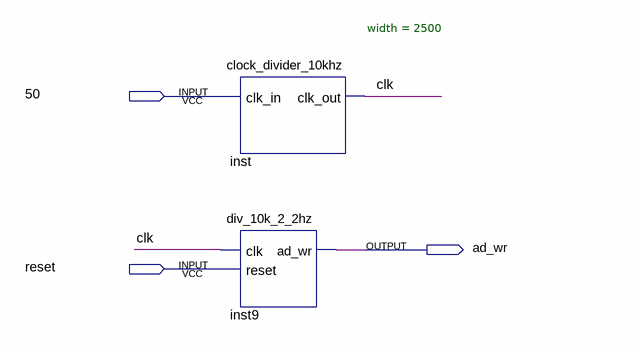
[diagram p0: schematic sheet]
// Quartus schematic lm35_adc.bdf as structural Verilog: 2 symbols, 3 pins
module lm35_adc (
  input  \50 ,
  input  reset,
  output ad_wr
);

  wire clk;

  clock_divider_10khz #(.width(2500)) inst (.clk_in(\50 ), .clk_out(clk));
  div_10k_2_2hz inst9 (.clk(clk), .reset(reset), .ad_wr(ad_wr));
endmodule
